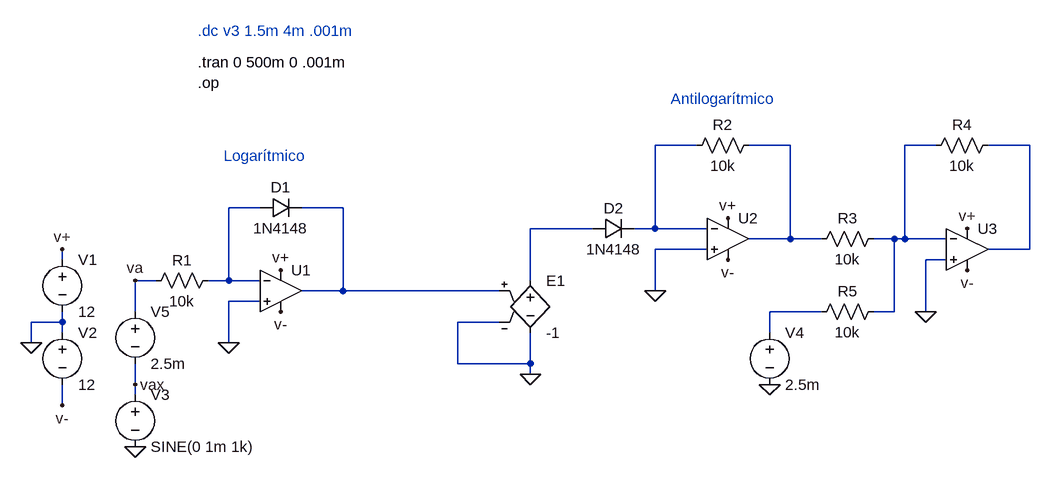
[diagram p0: schematic log y antilog.asc]
log y antilog.asc, the LTspice schematic file:
Version 4
SHEET 1 1432 680
WIRE -48 -432 -112 -432
WIRE 96 -432 32 -432
WIRE 320 -432 272 -432
WIRE 464 -432 400 -432
WIRE -720 -336 -768 -336
WIRE -592 -336 -656 -336
WIRE -208 -304 -304 -304
WIRE -112 -304 -112 -432
WIRE -112 -304 -144 -304
WIRE -32 -304 -112 -304
WIRE 96 -288 96 -432
WIRE 96 -288 32 -288
WIRE 144 -288 96 -288
WIRE 256 -288 224 -288
WIRE 272 -288 272 -432
WIRE 272 -288 256 -288
WIRE 336 -288 272 -288
WIRE -32 -272 -112 -272
WIRE 464 -272 464 -432
WIRE 464 -272 400 -272
WIRE -1024 -256 -1024 -272
WIRE 336 -256 304 -256
WIRE -880 -224 -912 -224
WIRE -768 -224 -768 -336
WIRE -768 -224 -800 -224
WIRE -720 -224 -768 -224
WIRE -304 -224 -304 -304
WIRE -592 -208 -592 -336
WIRE -592 -208 -656 -208
WIRE -352 -208 -592 -208
WIRE -112 -208 -112 -272
WIRE -720 -192 -768 -192
WIRE -912 -176 -912 -224
WIRE 144 -176 64 -176
WIRE 256 -176 256 -288
WIRE 256 -176 224 -176
WIRE 304 -176 304 -256
WIRE -1024 -160 -1024 -176
WIRE -1024 -160 -1072 -160
WIRE -352 -160 -416 -160
WIRE -1024 -144 -1024 -160
WIRE 64 -144 64 -176
WIRE -1072 -128 -1072 -160
WIRE -768 -128 -768 -192
WIRE -416 -96 -416 -160
WIRE -304 -96 -304 -144
WIRE -304 -96 -416 -96
WIRE -304 -80 -304 -96
WIRE -912 -64 -912 -96
WIRE -912 -48 -912 -64
WIRE -1024 -32 -1024 -64
FLAG -1072 -128 0
FLAG -912 32 0
FLAG -768 -128 0
FLAG -912 -224 va
FLAG -1024 -272 v+
FLAG -688 -240 v+
FLAG -1024 -32 v-
FLAG -688 -176 v-
FLAG -912 -64 vax
FLAG -304 -80 0
FLAG -112 -208 0
FLAG 0 -320 v+
FLAG 0 -256 v-
FLAG 368 -304 v+
FLAG 368 -240 v-
FLAG 304 -176 0
FLAG 64 -64 0
DATAFLAG -496 -208 ""
SYMBOL Opamps\\UniversalOpamp2 -688 -208 R0
SYMATTR InstName U1
SYMBOL diode -720 -320 R270
WINDOW 0 32 32 VTop 2
WINDOW 3 0 32 VBottom 2
SYMATTR InstName D1
SYMATTR Value 1N4148
SYMBOL voltage -1024 -272 R0
WINDOW 123 0 0 Left 2
WINDOW 39 0 0 Left 2
SYMATTR InstName V1
SYMATTR Value 12
SYMBOL voltage -1024 -160 R0
WINDOW 123 0 0 Left 2
WINDOW 39 0 0 Left 2
SYMATTR InstName V2
SYMATTR Value 12
SYMBOL res -784 -240 R90
WINDOW 0 0 56 VBottom 2
WINDOW 3 32 56 VTop 2
SYMATTR InstName R1
SYMATTR Value 10k
SYMBOL voltage -912 -64 R0
WINDOW 123 0 0 Left 2
WINDOW 39 0 0 Left 2
SYMATTR InstName V3
SYMATTR Value SINE(0 1m 1k)
SYMBOL voltage -912 -192 R0
WINDOW 123 0 0 Left 0
WINDOW 39 0 0 Left 0
SYMATTR InstName V5
SYMATTR Value 2.5m
SYMBOL e -304 -240 R0
SYMATTR InstName E1
SYMATTR Value -1
SYMBOL Opamps\\UniversalOpamp2 0 -288 R0
SYMATTR InstName U2
SYMBOL diode -208 -288 R270
WINDOW 0 32 32 VTop 2
WINDOW 3 0 32 VBottom 2
SYMATTR InstName D2
SYMATTR Value 1N4148
SYMBOL res 48 -448 R90
WINDOW 0 0 56 VBottom 2
WINDOW 3 32 56 VTop 2
SYMATTR InstName R2
SYMATTR Value 10k
SYMBOL Opamps\\UniversalOpamp2 368 -272 R0
SYMATTR InstName U3
SYMBOL res 240 -304 R90
WINDOW 0 0 56 VBottom 2
WINDOW 3 32 56 VTop 2
SYMATTR InstName R3
SYMATTR Value 10k
SYMBOL res 416 -448 R90
WINDOW 0 0 56 VBottom 2
WINDOW 3 32 56 VTop 2
SYMATTR InstName R4
SYMATTR Value 10k
SYMBOL res 240 -192 R90
WINDOW 0 0 56 VBottom 2
WINDOW 3 32 56 VTop 2
SYMATTR InstName R5
SYMATTR Value 10k
SYMBOL voltage 64 -160 R0
WINDOW 123 0 0 Left 0
WINDOW 39 0 0 Left 0
SYMATTR InstName V4
SYMATTR Value 2.5m
TEXT -816 -608 Left 2 ;.dc v3 1.5m 4m .001m
TEXT -816 -560 Left 2 !.tran 0 500m 0 .001m
TEXT -776 -416 Left 2 ;Logarítmico
TEXT -88 -504 Left 2 ;Antilogarítmico
TEXT -816 -528 Left 2 !.op

The netlist it stands for:
* log y antilog.asc
XU1 0 N005 v+ v- N006 level.2 Avol=1Meg GBW=10Meg Slew=10Meg ilimit=25m rail=0 Vos=0 phimargin=45 en=0 enk=0 in=0 ink=0 Rin=500Meg  ; pins IN+ IN- V+ V- OUT
D1 N005 N006 1N4148
V1 v+ 0 12
V2 0 v- 12
R1 N005 va 10k
V3 vax 0 SINE(0 1m 1k)
V5 va vax 2.5m
E1 N007 0 N006 0 -1
XU2 0 N001 v+ v- N002 level.2 Avol=1Meg GBW=10Meg Slew=10Meg ilimit=25m rail=0 Vos=0 phimargin=45 en=0 enk=0 in=0 ink=0 Rin=500Meg  ; pins IN+ IN- V+ V- OUT
D2 N007 N001 1N4148
R2 N002 N001 10k
XU3 0 N003 v+ v- N004 level.2 Avol=1Meg GBW=10Meg Slew=10Meg ilimit=25m rail=0 Vos=0 phimargin=45 en=0 enk=0 in=0 ink=0 Rin=500Meg  ; pins IN+ IN- V+ V- OUT
R3 N003 N002 10k
R4 N004 N003 10k
R5 N003 N008 10k
V4 N008 0 2.5m
.model D D
.lib standard.dio
* .dc v3 1.5m 4m .001m
.tran 0 500m 0 .001m
* Logarítmico
* Antilogarítmico
.op
.lib UniversalOpamps2.sub
.backanno
.end